# Altium schematic sheet 01_Block_Diagram.SchDoc: Block_Diagram
size 420 x 297 mm; Author: Lukas Henkel; DocumentNumber: 1; SheetNumber: 1; SheetTotal: 16; DocSize: A3
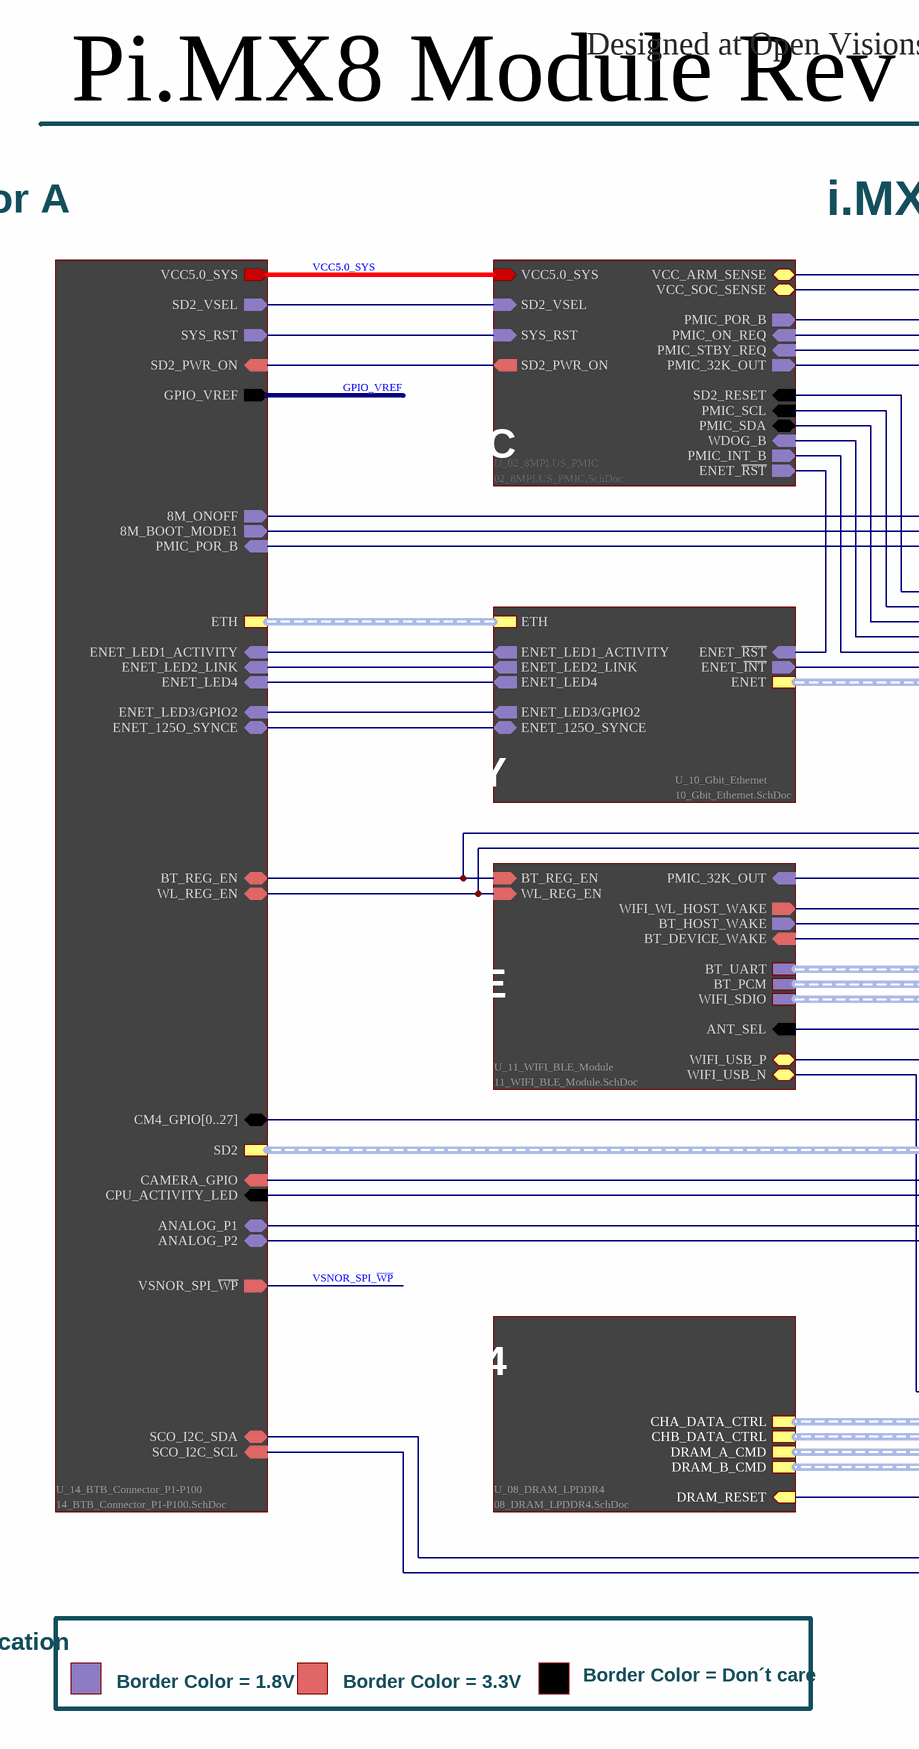
[diagram p0: 01_Block_Diagram.SchDoc, left]
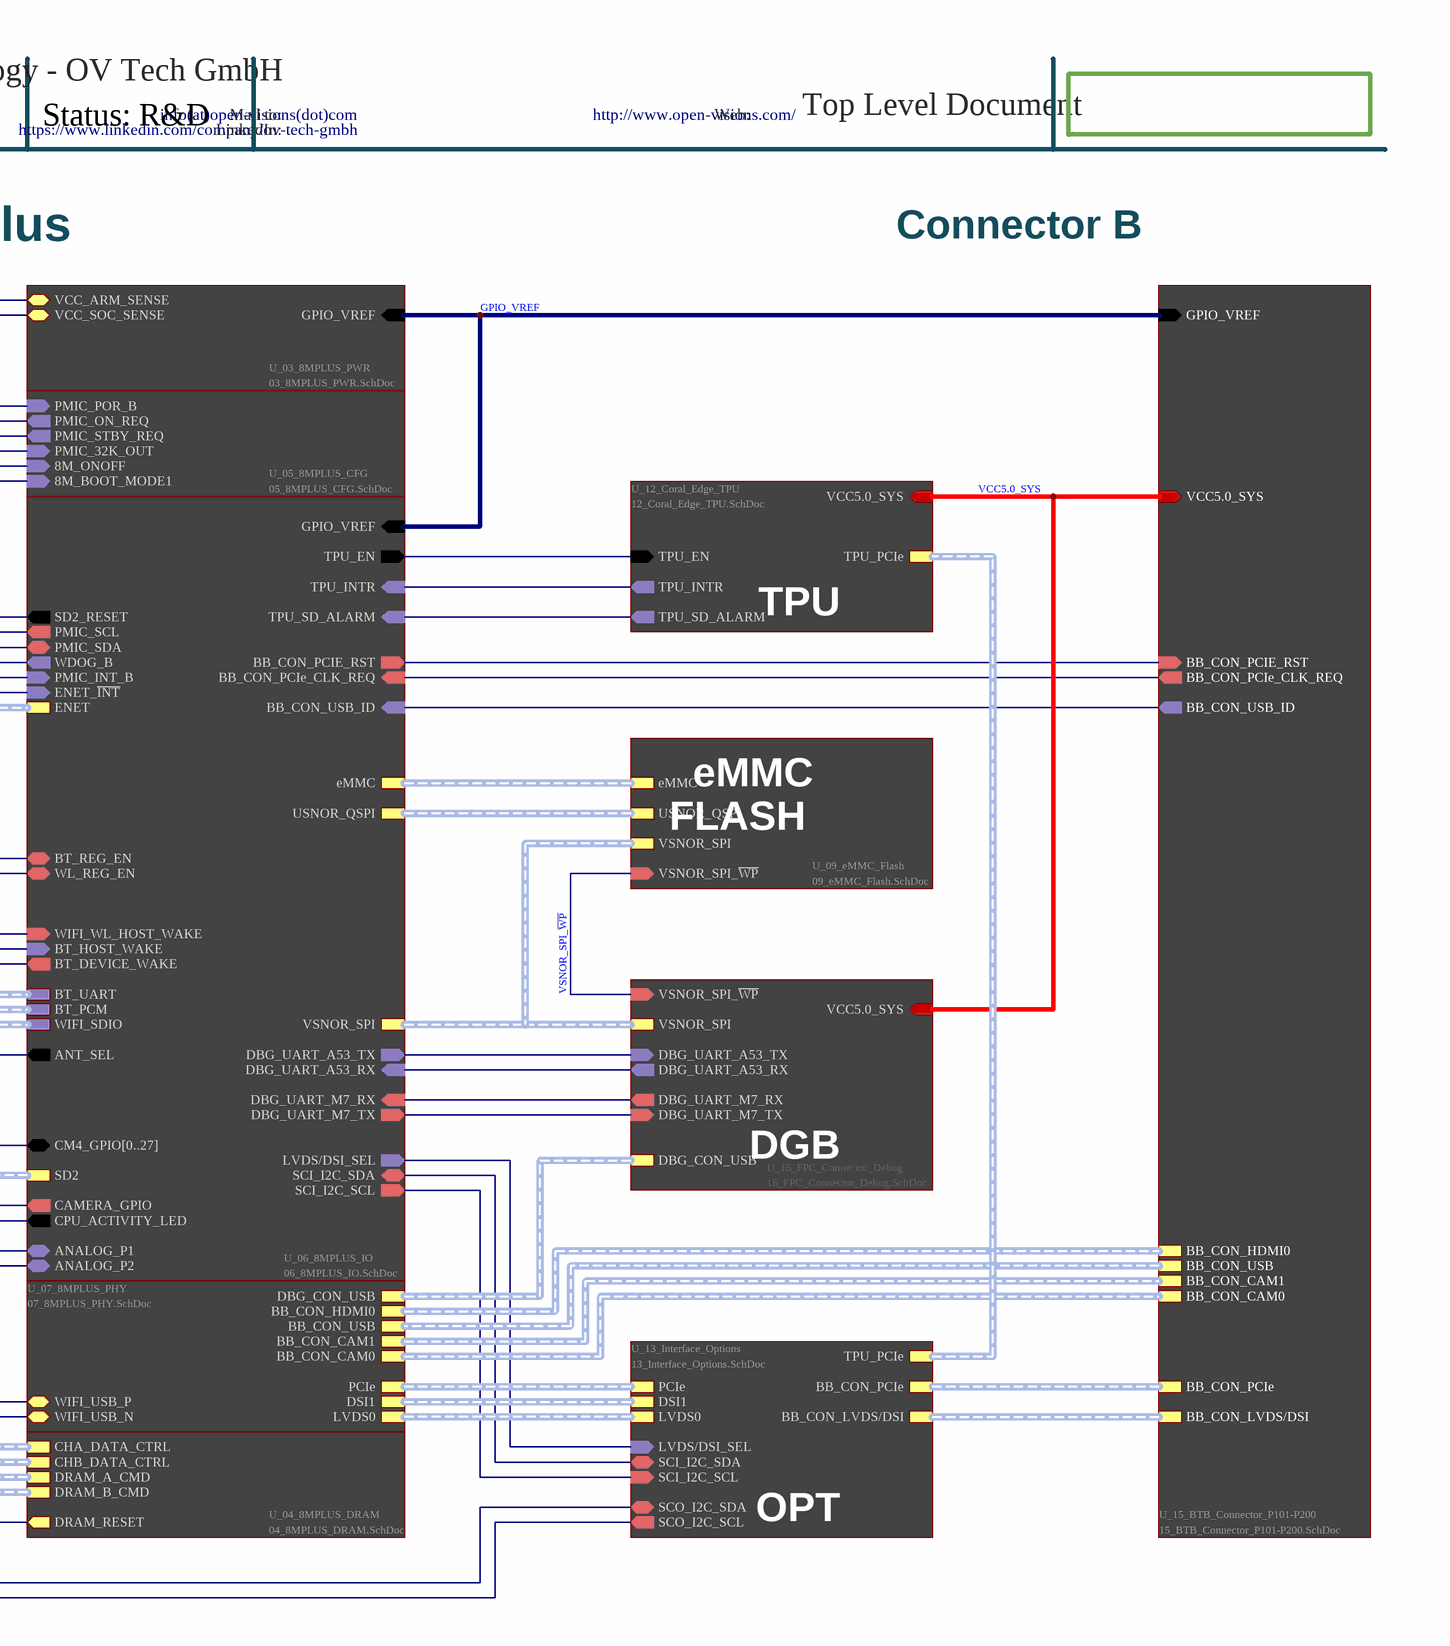
[diagram p1: 01_Block_Diagram.SchDoc, right]

## Parts
?  (no value)  (graphical)

## Sub-sheets
U_02_8MPLUS_PMIC = 02_8MPLUS_PMIC.SchDoc: VCC_ARM_SENSE (bidir), VCC_SOC_SENSE (bidir), VCC5.0_SYS (in), SD2_VSEL (in), SYS_RST (in), PMIC_ON_REQ (in), PMIC_STBY_REQ (in), WDOG_B (in), PMIC_SCL (in), PMIC_SDA (bidir), PMIC_POR_B (out), PMIC_INT_B (out), PMIC_32K_OUT (out), SD2_PWR_ON (out), SD2_RESET (in), ENET_~{RST} (out)
U_03_8MPLUS_PWR = 03_8MPLUS_PWR.SchDoc: VCC_ARM_SENSE (bidir), VCC_SOC_SENSE (bidir), GPIO_VREF (in)
U_04_8MPLUS_DRAM = 04_8MPLUS_DRAM.SchDoc: CHA_DATA_CTRL (harness CHA_DATA_CTRL), CHB_DATA_CTRL (harness CHB_DATA_CTRL), DRAM_A_CMD (harness DRAM_A_CMD), DRAM_B_CMD (harness DRAM_B_CMD), DRAM_RESET (out)
U_05_8MPLUS_CFG = 05_8MPLUS_CFG.SchDoc: 8M_ONOFF (in), PMIC_POR_B (in), PMIC_ON_REQ (out), PMIC_STBY_REQ (out), PMIC_32K_OUT (in), 8M_BOOT_MODE1 (in)
U_06_8MPLUS_IO = 06_8MPLUS_IO.SchDoc: ENET (harness ENET), SD2 (harness SD2), SD2_RESET (out), ENET_~{INT} (in), WDOG_B (out), PMIC_INT_B (in), WIFI_SDIO (harness WIFI_SDIO), BT_HOST_WAKE (in), BT_DEVICE_WAKE (out), BT_UART (harness BT_UART), BT_PCM (harness BT_PCM), eMMC (harness eMMC), USNOR_QSPI (harness USNOR_QSPI), VSNOR_SPI (harness VSNOR_SPI), TPU_INTR (in), TPU_SD_ALARM (in), WIFI_WL_HOST_WAKE (in), ANT_SEL (out), BB_CON_PCIE_RST (out), BB_CON_PCIe_CLK_REQ (in), SCI_I2C_SDA (bidir), SCI_I2C_SCL (out), CM4_GPIO[0..27] (bidir), ANALOG_P1 (bidir), ANALOG_P2 (bidir), CAMERA_GPIO (out), BB_CON_USB_ID (in), DBG_UART_M7_TX (out), DBG_UART_M7_RX (in), DBG_UART_A53_TX (out), DBG_UART_A53_RX (in), CPU_ACTIVITY_LED (out), GPIO_VREF (in), PMIC_SCL (out), PMIC_SDA (bidir), LVDS/DSI_SEL (out), TPU_EN (out), WL_REG_EN (bidir), BT_REG_EN (bidir)
U_07_8MPLUS_PHY = 07_8MPLUS_PHY.SchDoc: BB_CON_HDMI0 (harness BB_CON_HDMI0), BB_CON_USB (harness BB_CON_USB), PCIe (harness PCIe), BB_CON_CAM1 (harness BB_CON_CAM1), BB_CON_CAM0 (harness BB_CON_CAM0), DSI1 (harness DSI1), LVDS0 (harness LVDS0), DBG_CON_USB (harness DBG_CON_USB), WIFI_USB_P (bidir), WIFI_USB_N (bidir)
U_08_DRAM_LPDDR4 = 08_DRAM_LPDDR4.SchDoc: DRAM_A_CMD (harness DRAM_A_CMD), DRAM_B_CMD (harness DRAM_B_CMD), DRAM_RESET (in), CHA_DATA_CTRL (harness CHA_DATA_CTRL), CHB_DATA_CTRL (harness CHB_DATA_CTRL)
U_09_eMMC_Flash = 09_eMMC_Flash.SchDoc: eMMC (harness eMMC), USNOR_QSPI (harness USNOR_QSPI), VSNOR_SPI (harness VSNOR_SPI), VSNOR_SPI_~{WP} (in)
U_10_Gbit_Ethernet = 10_Gbit_Ethernet.SchDoc: ENET (harness ENET), ENET_~{RST} (in), ENET_~{INT} (out), ETH (harness ETH), ENET_LED4 (out), ENET_LED1_ACTIVITY (out), ENET_LED2_LINK (out), ENET_125O_SYNCE (bidir), ENET_LED3/GPIO2 (out)
U_11_WIFI_BLE_Module = 11_WIFI_BLE_Module.SchDoc: ANT_SEL (in), BT_UART (harness BT_UART), WIFI_WL_HOST_WAKE (out), BT_PCM (harness BT_PCM), WIFI_SDIO (harness WIFI_SDIO), BT_HOST_WAKE (out), BT_DEVICE_WAKE (in), BT_REG_EN (in), WL_REG_EN (in), WIFI_USB_P (bidir), WIFI_USB_N (bidir), PMIC_32K_OUT (in)
U_12_Coral_Edge_TPU = 12_Coral_Edge_TPU.SchDoc: VCC5.0_SYS (in), TPU_EN (in), TPU_INTR (out), TPU_SD_ALARM (out), TPU_PCIe (harness TPU_PCIe)
U_13_Interface_Options = 13_Interface_Options.SchDoc: PCIe (harness PCIe), TPU_PCIe (harness TPU_PCIe), BB_CON_PCIe (harness BB_CON_PCIe), BB_CON_LVDS/DSI (harness BB_CON_LVDS/DSI), DSI1 (harness DSI1), LVDS0 (harness LVDS0), LVDS/DSI_SEL (in), SCI_I2C_SDA (bidir), SCI_I2C_SCL (in), SCO_I2C_SCL (out), SCO_I2C_SDA (bidir)
U_14_BTB_Connector_P1-P100 = 14_BTB_Connector_P1-P100.SchDoc: ETH (harness ETH), ENET_LED4 (in), ENET_LED1_ACTIVITY (in), ENET_LED2_LINK (in), CPU_ACTIVITY_LED (in), ENET_125O_SYNCE (bidir), ENET_LED3/GPIO2 (in), VSNOR_SPI_~{WP} (out), SD2_PWR_ON (in), VCC5.0_SYS (out), BT_REG_EN (bidir), WL_REG_EN (bidir), 8M_BOOT_MODE1 (out), CAMERA_GPIO (in), 8M_ONOFF (out), SD2 (harness SD2), SD2_VSEL (out), GPIO_VREF (out), PMIC_POR_B (in), ANALOG_P1 (bidir), ANALOG_P2 (bidir), CM4_GPIO[0..27] (bidir), SCO_I2C_SCL (in), SCO_I2C_SDA (bidir), SYS_RST (out)
U_15_BTB_Connector_P101-P200 = 15_BTB_Connector_P101-P200.SchDoc: BB_CON_USB (harness BB_CON_USB), BB_CON_USB_ID (out), BB_CON_PCIe (harness BB_CON_PCIe), BB_CON_PCIe_CLK_REQ (out), BB_CON_PCIE_RST (in), BB_CON_CAM1 (harness BB_CON_CAM1), BB_CON_CAM0 (harness BB_CON_CAM0), VCC5.0_SYS (in), BB_CON_HDMI0 (harness BB_CON_HDMI0), BB_CON_LVDS/DSI (harness BB_CON_LVDS/DSI), GPIO_VREF (in)
U_16_FPC_Connector_Debug = 16_FPC_Connector_Debug.SchDoc: DBG_CON_USB (harness DBG_CON_USB), DBG_UART_A53_TX (in), DBG_UART_A53_RX (out), VSNOR_SPI (harness VSNOR_SPI), VSNOR_SPI_~{WP} (in), VCC5.0_SYS (in), DBG_UART_M7_TX (in), DBG_UART_M7_RX (out)

## Nets
GPIO_VREF: sheet U_03_8MPLUS_PWR/GPIO_VREF, sheet U_06_8MPLUS_IO/GPIO_VREF, sheet U_14_BTB_Connector_P1-P100/GPIO_VREF, sheet U_15_BTB_Connector_P101-P200/GPIO_VREF
VCC5.0_SYS: sheet U_02_8MPLUS_PMIC/VCC5.0_SYS, sheet U_12_Coral_Edge_TPU/VCC5.0_SYS, sheet U_14_BTB_Connector_P1-P100/VCC5.0_SYS, sheet U_15_BTB_Connector_P101-P200/VCC5.0_SYS, sheet U_16_FPC_Connector_Debug/VCC5.0_SYS
VSNOR_SPI_~{WP}: sheet U_09_eMMC_Flash/VSNOR_SPI_~{WP}, sheet U_14_BTB_Connector_P1-P100/VSNOR_SPI_~{WP}, sheet U_16_FPC_Connector_Debug/VSNOR_SPI_~{WP}
(unnamed): sheet U_02_8MPLUS_PMIC/VCC_ARM_SENSE, sheet U_03_8MPLUS_PWR/VCC_ARM_SENSE
(unnamed): sheet U_02_8MPLUS_PMIC/VCC_SOC_SENSE, sheet U_03_8MPLUS_PWR/VCC_SOC_SENSE
(unnamed): sheet U_02_8MPLUS_PMIC/SD2_VSEL, sheet U_14_BTB_Connector_P1-P100/SD2_VSEL
(unnamed): sheet U_02_8MPLUS_PMIC/SYS_RST, sheet U_14_BTB_Connector_P1-P100/SYS_RST
(unnamed): sheet U_02_8MPLUS_PMIC/PMIC_ON_REQ, sheet U_05_8MPLUS_CFG/PMIC_ON_REQ
(unnamed): sheet U_02_8MPLUS_PMIC/PMIC_STBY_REQ, sheet U_05_8MPLUS_CFG/PMIC_STBY_REQ
(unnamed): sheet U_02_8MPLUS_PMIC/WDOG_B, sheet U_06_8MPLUS_IO/WDOG_B
(unnamed): sheet U_02_8MPLUS_PMIC/PMIC_SCL, sheet U_06_8MPLUS_IO/PMIC_SCL
(unnamed): sheet U_02_8MPLUS_PMIC/PMIC_SDA, sheet U_06_8MPLUS_IO/PMIC_SDA
(unnamed): sheet U_02_8MPLUS_PMIC/PMIC_POR_B, sheet U_05_8MPLUS_CFG/PMIC_POR_B, sheet U_14_BTB_Connector_P1-P100/PMIC_POR_B
(unnamed): sheet U_02_8MPLUS_PMIC/PMIC_INT_B, sheet U_06_8MPLUS_IO/PMIC_INT_B
(unnamed): sheet U_02_8MPLUS_PMIC/PMIC_32K_OUT, sheet U_05_8MPLUS_CFG/PMIC_32K_OUT, sheet U_11_WIFI_BLE_Module/PMIC_32K_OUT
(unnamed): sheet U_02_8MPLUS_PMIC/SD2_PWR_ON, sheet U_14_BTB_Connector_P1-P100/SD2_PWR_ON
(unnamed): sheet U_02_8MPLUS_PMIC/SD2_RESET, sheet U_06_8MPLUS_IO/SD2_RESET
(unnamed): sheet U_02_8MPLUS_PMIC/ENET_~{RST}, sheet U_10_Gbit_Ethernet/ENET_~{RST}
(unnamed): sheet U_04_8MPLUS_DRAM/DRAM_RESET, sheet U_08_DRAM_LPDDR4/DRAM_RESET
(unnamed): sheet U_05_8MPLUS_CFG/8M_ONOFF, sheet U_14_BTB_Connector_P1-P100/8M_ONOFF
(unnamed): sheet U_05_8MPLUS_CFG/8M_BOOT_MODE1, sheet U_14_BTB_Connector_P1-P100/8M_BOOT_MODE1
(unnamed): sheet U_06_8MPLUS_IO/ENET_~{INT}, sheet U_10_Gbit_Ethernet/ENET_~{INT}
(unnamed): sheet U_06_8MPLUS_IO/BT_HOST_WAKE, sheet U_11_WIFI_BLE_Module/BT_HOST_WAKE
(unnamed): sheet U_06_8MPLUS_IO/BT_DEVICE_WAKE, sheet U_11_WIFI_BLE_Module/BT_DEVICE_WAKE
(unnamed): sheet U_06_8MPLUS_IO/TPU_INTR, sheet U_12_Coral_Edge_TPU/TPU_INTR
(unnamed): sheet U_06_8MPLUS_IO/TPU_SD_ALARM, sheet U_12_Coral_Edge_TPU/TPU_SD_ALARM
(unnamed): sheet U_06_8MPLUS_IO/WIFI_WL_HOST_WAKE, sheet U_11_WIFI_BLE_Module/WIFI_WL_HOST_WAKE
(unnamed): sheet U_06_8MPLUS_IO/ANT_SEL, sheet U_11_WIFI_BLE_Module/ANT_SEL
(unnamed): sheet U_06_8MPLUS_IO/BB_CON_PCIE_RST, sheet U_15_BTB_Connector_P101-P200/BB_CON_PCIE_RST
(unnamed): sheet U_06_8MPLUS_IO/BB_CON_PCIe_CLK_REQ, sheet U_15_BTB_Connector_P101-P200/BB_CON_PCIe_CLK_REQ
(unnamed): sheet U_06_8MPLUS_IO/SCI_I2C_SDA, sheet U_13_Interface_Options/SCI_I2C_SDA
(unnamed): sheet U_06_8MPLUS_IO/SCI_I2C_SCL, sheet U_13_Interface_Options/SCI_I2C_SCL
(unnamed): sheet U_06_8MPLUS_IO/ANALOG_P1, sheet U_14_BTB_Connector_P1-P100/ANALOG_P1
(unnamed): sheet U_06_8MPLUS_IO/ANALOG_P2, sheet U_14_BTB_Connector_P1-P100/ANALOG_P2
(unnamed): sheet U_06_8MPLUS_IO/CAMERA_GPIO, sheet U_14_BTB_Connector_P1-P100/CAMERA_GPIO
(unnamed): sheet U_06_8MPLUS_IO/BB_CON_USB_ID, sheet U_15_BTB_Connector_P101-P200/BB_CON_USB_ID
(unnamed): sheet U_06_8MPLUS_IO/DBG_UART_M7_TX, sheet U_16_FPC_Connector_Debug/DBG_UART_M7_TX
(unnamed): sheet U_06_8MPLUS_IO/DBG_UART_M7_RX, sheet U_16_FPC_Connector_Debug/DBG_UART_M7_RX
(unnamed): sheet U_06_8MPLUS_IO/DBG_UART_A53_TX, sheet U_16_FPC_Connector_Debug/DBG_UART_A53_TX
(unnamed): sheet U_06_8MPLUS_IO/DBG_UART_A53_RX, sheet U_16_FPC_Connector_Debug/DBG_UART_A53_RX
(unnamed): sheet U_06_8MPLUS_IO/CPU_ACTIVITY_LED, sheet U_14_BTB_Connector_P1-P100/CPU_ACTIVITY_LED
(unnamed): sheet U_06_8MPLUS_IO/LVDS/DSI_SEL, sheet U_13_Interface_Options/LVDS/DSI_SEL
(unnamed): sheet U_06_8MPLUS_IO/TPU_EN, sheet U_12_Coral_Edge_TPU/TPU_EN
(unnamed): sheet U_06_8MPLUS_IO/WL_REG_EN, sheet U_11_WIFI_BLE_Module/WL_REG_EN, sheet U_14_BTB_Connector_P1-P100/WL_REG_EN
(unnamed): sheet U_06_8MPLUS_IO/BT_REG_EN, sheet U_11_WIFI_BLE_Module/BT_REG_EN, sheet U_14_BTB_Connector_P1-P100/BT_REG_EN
(unnamed): sheet U_07_8MPLUS_PHY/WIFI_USB_P, sheet U_11_WIFI_BLE_Module/WIFI_USB_P
(unnamed): sheet U_07_8MPLUS_PHY/WIFI_USB_N, sheet U_11_WIFI_BLE_Module/WIFI_USB_N
(unnamed): sheet U_10_Gbit_Ethernet/ENET_LED4, sheet U_14_BTB_Connector_P1-P100/ENET_LED4
(unnamed): sheet U_10_Gbit_Ethernet/ENET_LED1_ACTIVITY, sheet U_14_BTB_Connector_P1-P100/ENET_LED1_ACTIVITY
(unnamed): sheet U_10_Gbit_Ethernet/ENET_LED2_LINK, sheet U_14_BTB_Connector_P1-P100/ENET_LED2_LINK
(unnamed): sheet U_10_Gbit_Ethernet/ENET_125O_SYNCE, sheet U_14_BTB_Connector_P1-P100/ENET_125O_SYNCE
(unnamed): sheet U_10_Gbit_Ethernet/ENET_LED3/GPIO2, sheet U_14_BTB_Connector_P1-P100/ENET_LED3/GPIO2
(unnamed): sheet U_13_Interface_Options/SCO_I2C_SCL, sheet U_14_BTB_Connector_P1-P100/SCO_I2C_SCL
(unnamed): sheet U_13_Interface_Options/SCO_I2C_SDA, sheet U_14_BTB_Connector_P1-P100/SCO_I2C_SDA

## Buses and harness runs
bus sheet U_06_8MPLUS_IO/CM4_GPIO[0..27] = sheet U_14_BTB_Connector_P1-P100/CM4_GPIO[0..27]
harness sheet U_04_8MPLUS_DRAM/CHA_DATA_CTRL = sheet U_08_DRAM_LPDDR4/CHA_DATA_CTRL
harness sheet U_04_8MPLUS_DRAM/CHB_DATA_CTRL = sheet U_08_DRAM_LPDDR4/CHB_DATA_CTRL
harness sheet U_04_8MPLUS_DRAM/DRAM_A_CMD = sheet U_08_DRAM_LPDDR4/DRAM_A_CMD
harness sheet U_04_8MPLUS_DRAM/DRAM_B_CMD = sheet U_08_DRAM_LPDDR4/DRAM_B_CMD
harness sheet U_06_8MPLUS_IO/BT_PCM = sheet U_11_WIFI_BLE_Module/BT_PCM
harness sheet U_06_8MPLUS_IO/BT_UART = sheet U_11_WIFI_BLE_Module/BT_UART
harness sheet U_06_8MPLUS_IO/eMMC = sheet U_09_eMMC_Flash/eMMC
harness sheet U_06_8MPLUS_IO/ENET = sheet U_10_Gbit_Ethernet/ENET
harness sheet U_06_8MPLUS_IO/SD2 = sheet U_14_BTB_Connector_P1-P100/SD2
harness sheet U_06_8MPLUS_IO/USNOR_QSPI = sheet U_09_eMMC_Flash/USNOR_QSPI
harness sheet U_06_8MPLUS_IO/VSNOR_SPI = sheet U_09_eMMC_Flash/VSNOR_SPI = sheet U_16_FPC_Connector_Debug/VSNOR_SPI
harness sheet U_06_8MPLUS_IO/WIFI_SDIO = sheet U_11_WIFI_BLE_Module/WIFI_SDIO
harness sheet U_07_8MPLUS_PHY/BB_CON_CAM0 = sheet U_15_BTB_Connector_P101-P200/BB_CON_CAM0
harness sheet U_07_8MPLUS_PHY/BB_CON_CAM1 = sheet U_15_BTB_Connector_P101-P200/BB_CON_CAM1
harness sheet U_07_8MPLUS_PHY/BB_CON_HDMI0 = sheet U_15_BTB_Connector_P101-P200/BB_CON_HDMI0
harness sheet U_07_8MPLUS_PHY/BB_CON_USB = sheet U_15_BTB_Connector_P101-P200/BB_CON_USB
harness sheet U_07_8MPLUS_PHY/DBG_CON_USB = sheet U_16_FPC_Connector_Debug/DBG_CON_USB
harness sheet U_07_8MPLUS_PHY/DSI1 = sheet U_13_Interface_Options/DSI1
harness sheet U_07_8MPLUS_PHY/LVDS0 = sheet U_13_Interface_Options/LVDS0
harness sheet U_07_8MPLUS_PHY/PCIe = sheet U_13_Interface_Options/PCIe
harness sheet U_10_Gbit_Ethernet/ETH = sheet U_14_BTB_Connector_P1-P100/ETH
harness sheet U_12_Coral_Edge_TPU/TPU_PCIe = sheet U_13_Interface_Options/TPU_PCIe
harness sheet U_13_Interface_Options/BB_CON_LVDS/DSI = sheet U_15_BTB_Connector_P101-P200/BB_CON_LVDS/DSI
harness sheet U_13_Interface_Options/BB_CON_PCIe = sheet U_15_BTB_Connector_P101-P200/BB_CON_PCIe

## Notes on the sheet
- Pi.MX8 Module Rev 0.3
- Status: R&D
- Designed at Open Visions Technology - OV Tech GmbH
- Mail to:
- LinkedIn:
- info(at)open-visions(dot)com
- https://www.linkedin.com/company/ov-tech-gmbh
- Web:
- http://www.open-visions.com/
- Top Level Document
- Connector A
- i.MX 8M Plus
- Connector B
- PMIC
- TPU
- GBit PHY
- FLASH
- eMMC
- WIFI/BLE
- DGB
- LPDDR4
- OPT
- Signal Level Indication
- Border Color = 1.8V
- Border Color = 3.3V
- Border Color = Don´t care
- OV Tech GmbH - Open Visions Technology

## Library data of the parts
? = Titleblock_01_OpenSource